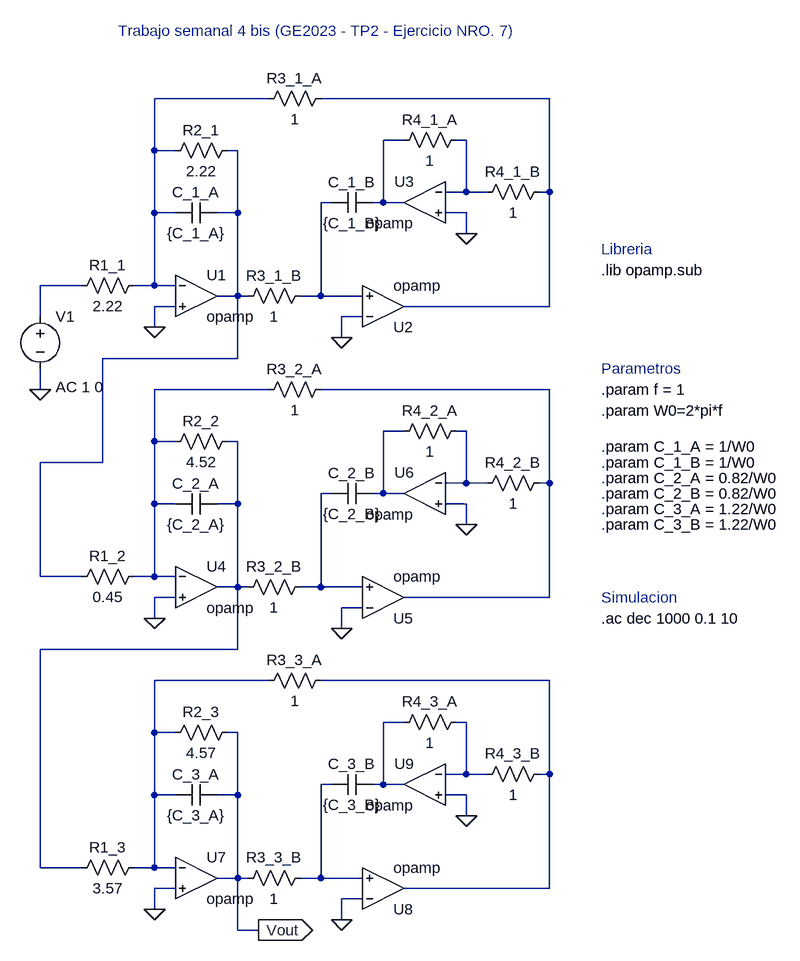
[diagram p0: schematic TS4bis_Albanesi_Pereyra_LTSpice.asc]
TS4bis_Albanesi_Pereyra_LTSpice.asc, the LTspice schematic file:
Version 4
SHEET 1 1068 1256
WIRE 256 -96 80 -96
WIRE 688 -96 336 -96
WIRE 464 -32 432 -32
WIRE 560 -32 544 -32
WIRE 80 -16 80 -96
WIRE 112 -16 80 -16
WIRE 208 -16 192 -16
WIRE 560 48 560 -32
WIRE 560 48 528 48
WIRE 592 48 560 48
WIRE 688 48 688 -96
WIRE 688 48 672 48
WIRE 352 64 336 64
WIRE 432 64 432 -32
WIRE 432 64 416 64
WIRE 464 64 432 64
WIRE 80 80 80 -16
WIRE 112 80 80 80
WIRE 208 80 208 -16
WIRE 208 80 176 80
WIRE 560 80 528 80
WIRE 560 112 560 80
WIRE -32 192 -96 192
WIRE 80 192 80 80
WIRE 80 192 48 192
WIRE 112 192 80 192
WIRE 208 208 208 80
WIRE 208 208 176 208
WIRE 224 208 208 208
WIRE 336 208 336 64
WIRE 336 208 304 208
WIRE 400 208 336 208
WIRE 112 224 80 224
WIRE 688 224 688 48
WIRE 688 224 464 224
WIRE -96 240 -96 192
WIRE 400 240 368 240
WIRE 80 256 80 224
WIRE 368 272 368 240
WIRE 208 304 208 208
WIRE 208 304 0 304
WIRE -96 352 -96 320
WIRE 256 352 80 352
WIRE 688 352 336 352
WIRE 464 416 432 416
WIRE 560 416 544 416
WIRE 80 432 80 352
WIRE 112 432 80 432
WIRE 208 432 192 432
WIRE 0 464 0 304
WIRE 0 464 -96 464
WIRE 560 496 560 416
WIRE 560 496 528 496
WIRE 592 496 560 496
WIRE 688 496 688 352
WIRE 688 496 672 496
WIRE 352 512 336 512
WIRE 432 512 432 416
WIRE 432 512 416 512
WIRE 464 512 432 512
WIRE 80 528 80 432
WIRE 112 528 80 528
WIRE 208 528 208 432
WIRE 208 528 176 528
WIRE 560 528 528 528
WIRE 560 560 560 528
WIRE -96 640 -96 464
WIRE -32 640 -96 640
WIRE 80 640 80 528
WIRE 80 640 48 640
WIRE 112 640 80 640
WIRE 208 656 208 528
WIRE 208 656 176 656
WIRE 224 656 208 656
WIRE 336 656 336 512
WIRE 336 656 304 656
WIRE 400 656 336 656
WIRE 112 672 80 672
WIRE 688 672 688 496
WIRE 688 672 464 672
WIRE 400 688 368 688
WIRE 80 704 80 672
WIRE 368 720 368 688
WIRE 208 752 208 656
WIRE 208 752 -96 752
WIRE 256 800 80 800
WIRE 688 800 336 800
WIRE 464 864 432 864
WIRE 560 864 544 864
WIRE 80 880 80 800
WIRE 112 880 80 880
WIRE 208 880 192 880
WIRE 560 944 560 864
WIRE 560 944 528 944
WIRE 592 944 560 944
WIRE 688 944 688 800
WIRE 688 944 672 944
WIRE 352 960 336 960
WIRE 432 960 432 864
WIRE 432 960 416 960
WIRE 464 960 432 960
WIRE 80 976 80 880
WIRE 112 976 80 976
WIRE 208 976 208 880
WIRE 208 976 176 976
WIRE 560 976 528 976
WIRE 560 1008 560 976
WIRE -96 1088 -96 752
WIRE -32 1088 -96 1088
WIRE 80 1088 80 976
WIRE 80 1088 48 1088
WIRE 112 1088 80 1088
WIRE 208 1104 208 976
WIRE 208 1104 176 1104
WIRE 224 1104 208 1104
WIRE 336 1104 336 960
WIRE 336 1104 304 1104
WIRE 400 1104 336 1104
WIRE 112 1120 80 1120
WIRE 688 1120 688 944
WIRE 688 1120 464 1120
WIRE 400 1136 368 1136
WIRE 80 1152 80 1120
WIRE 368 1168 368 1136
WIRE 208 1184 208 1104
WIRE 240 1184 208 1184
FLAG 80 256 0
FLAG 368 272 0
FLAG 560 112 0
FLAG -96 352 0
FLAG 80 704 0
FLAG 368 720 0
FLAG 560 560 0
FLAG 80 1152 0
FLAG 368 1168 0
FLAG 560 1008 0
FLAG 240 1184 Vout
IOPIN 240 1184 Out
SYMBOL res 64 176 R90
WINDOW 0 0 56 VBottom 2
WINDOW 3 32 56 VTop 2
SYMATTR InstName R1_1
SYMATTR Value 2.22
SYMBOL res 208 -32 R90
WINDOW 0 0 56 VBottom 2
WINDOW 3 32 56 VTop 2
SYMATTR InstName R2_1
SYMATTR Value 2.22
SYMBOL cap 176 64 R90
WINDOW 0 0 32 VBottom 2
WINDOW 3 32 32 VTop 2
SYMATTR InstName C_1_A
SYMATTR Value {C_1_A}
SYMBOL OpAmps\\opamp 144 144 R0
SYMATTR InstName U1
SYMBOL OpAmps\\opamp 432 288 M180
SYMATTR InstName U2
SYMBOL OpAmps\\opamp 496 0 M0
SYMATTR InstName U3
SYMBOL cap 416 48 R90
WINDOW 0 0 32 VBottom 2
WINDOW 3 32 32 VTop 2
SYMATTR InstName C_1_B
SYMATTR Value {C_1_B}
SYMBOL res 320 192 R90
WINDOW 0 0 56 VBottom 2
WINDOW 3 32 56 VTop 2
SYMATTR InstName R3_1_B
SYMATTR Value 1
SYMBOL res 688 32 R90
WINDOW 0 0 56 VBottom 2
WINDOW 3 32 56 VTop 2
SYMATTR InstName R4_1_B
SYMATTR Value 1
SYMBOL res 560 -48 R90
WINDOW 0 0 56 VBottom 2
WINDOW 3 32 56 VTop 2
SYMATTR InstName R4_1_A
SYMATTR Value 1
SYMBOL res 352 -112 R90
WINDOW 0 0 56 VBottom 2
WINDOW 3 32 56 VTop 2
SYMATTR InstName R3_1_A
SYMATTR Value 1
SYMBOL voltage -96 224 R0
WINDOW 123 24 124 Left 2
WINDOW 39 0 0 Left 0
SYMATTR Value2 AC 1 0
SYMATTR InstName V1
SYMATTR Value ""
SYMBOL res 64 624 R90
WINDOW 0 0 56 VBottom 2
WINDOW 3 32 56 VTop 2
SYMATTR InstName R1_2
SYMATTR Value 0.45
SYMBOL res 208 416 R90
WINDOW 0 0 56 VBottom 2
WINDOW 3 32 56 VTop 2
SYMATTR InstName R2_2
SYMATTR Value 4.52
SYMBOL cap 176 512 R90
WINDOW 0 0 32 VBottom 2
WINDOW 3 32 32 VTop 2
SYMATTR InstName C_2_A
SYMATTR Value {C_2_A}
SYMBOL OpAmps\\opamp 144 592 R0
SYMATTR InstName U4
SYMBOL OpAmps\\opamp 432 736 M180
SYMATTR InstName U5
SYMBOL OpAmps\\opamp 496 448 M0
SYMATTR InstName U6
SYMBOL cap 416 496 R90
WINDOW 0 0 32 VBottom 2
WINDOW 3 32 32 VTop 2
SYMATTR InstName C_2_B
SYMATTR Value {C_2_B}
SYMBOL res 320 640 R90
WINDOW 0 0 56 VBottom 2
WINDOW 3 32 56 VTop 2
SYMATTR InstName R3_2_B
SYMATTR Value 1
SYMBOL res 688 480 R90
WINDOW 0 0 56 VBottom 2
WINDOW 3 32 56 VTop 2
SYMATTR InstName R4_2_B
SYMATTR Value 1
SYMBOL res 560 400 R90
WINDOW 0 0 56 VBottom 2
WINDOW 3 32 56 VTop 2
SYMATTR InstName R4_2_A
SYMATTR Value 1
SYMBOL res 352 336 R90
WINDOW 0 0 56 VBottom 2
WINDOW 3 32 56 VTop 2
SYMATTR InstName R3_2_A
SYMATTR Value 1
SYMBOL res 64 1072 R90
WINDOW 0 0 56 VBottom 2
WINDOW 3 32 56 VTop 2
SYMATTR InstName R1_3
SYMATTR Value 3.57
SYMBOL res 208 864 R90
WINDOW 0 0 56 VBottom 2
WINDOW 3 32 56 VTop 2
SYMATTR InstName R2_3
SYMATTR Value 4.57
SYMBOL cap 176 960 R90
WINDOW 0 0 32 VBottom 2
WINDOW 3 32 32 VTop 2
SYMATTR InstName C_3_A
SYMATTR Value {C_3_A}
SYMBOL OpAmps\\opamp 144 1040 R0
SYMATTR InstName U7
SYMBOL OpAmps\\opamp 432 1184 M180
SYMATTR InstName U8
SYMBOL OpAmps\\opamp 496 896 M0
SYMATTR InstName U9
SYMBOL cap 416 944 R90
WINDOW 0 0 32 VBottom 2
WINDOW 3 32 32 VTop 2
SYMATTR InstName C_3_B
SYMATTR Value {C_3_B}
SYMBOL res 320 1088 R90
WINDOW 0 0 56 VBottom 2
WINDOW 3 32 56 VTop 2
SYMATTR InstName R3_3_B
SYMATTR Value 1
SYMBOL res 688 928 R90
WINDOW 0 0 56 VBottom 2
WINDOW 3 32 56 VTop 2
SYMATTR InstName R4_3_B
SYMATTR Value 1
SYMBOL res 560 848 R90
WINDOW 0 0 56 VBottom 2
WINDOW 3 32 56 VTop 2
SYMATTR InstName R4_3_A
SYMATTR Value 1
SYMBOL res 352 784 R90
WINDOW 0 0 56 VBottom 2
WINDOW 3 32 56 VTop 2
SYMATTR InstName R3_3_A
SYMATTR Value 1
TEXT 768 384 Left 2 !.param W0=2*pi*f
TEXT 768 352 Left 2 !.param f = 1
TEXT 768 168 Left 2 !.lib opamp.sub
TEXT 768 136 Left 2 ;Libreria
TEXT 768 320 Left 2 ;Parametros
TEXT 768 440 Left 2 !.param C_1_A = 1/W0
TEXT 768 464 Left 2 !.param C_1_B = 1/W0
TEXT 768 488 Left 2 !.param C_2_A = 0.82/W0
TEXT 768 512 Left 2 !.param C_2_B = 0.82/W0
TEXT 768 536 Left 2 !.param C_3_A = 1.22/W0
TEXT 768 560 Left 2 !.param C_3_B = 1.22/W0
TEXT 768 672 Left 2 ;Simulacion
TEXT 768 704 Left 2 !.ac dec 1000 0.1 10
TEXT 24 -200 Left 2 ;Trabajo semanal 4 bis (GE2023 - TP2 - Ejercicio NRO. 7)

The netlist it stands for:
* TS4bis_Albanesi_Pereyra_LTSpice.asc
R1_1 N001 N007 2.22
R2_1 N005 N001 2.22
C_1_A N005 N001 {C_1_A}
XU1 N001 0 N005 opamp Aol=100K GBW=10Meg  ; pins invin noninvin out
XU2 0 N006 N002 opamp Aol=100K GBW=10Meg  ; pins invin noninvin out
XU3 N004 0 N003 opamp Aol=100K GBW=10Meg  ; pins invin noninvin out
C_1_B N003 N006 {C_1_B}
R3_1_B N006 N005 1
R4_1_B N002 N004 1
R4_1_A N004 N003 1
R3_1_A N002 N001 1
V1 N007 0 AC 1 0
R1_2 N008 N005 0.45
R2_2 N012 N008 4.52
C_2_A N012 N008 {C_2_A}
XU4 N008 0 N012 opamp Aol=100K GBW=10Meg  ; pins invin noninvin out
XU5 0 N013 N009 opamp Aol=100K GBW=10Meg  ; pins invin noninvin out
XU6 N011 0 N010 opamp Aol=100K GBW=10Meg  ; pins invin noninvin out
C_2_B N010 N013 {C_2_B}
R3_2_B N013 N012 1
R4_2_B N009 N011 1
R4_2_A N011 N010 1
R3_2_A N009 N008 1
R1_3 N014 N012 3.57
R2_3 Vout N014 4.57
C_3_A Vout N014 {C_3_A}
XU7 N014 0 Vout opamp Aol=100K GBW=10Meg  ; pins invin noninvin out
XU8 0 N018 N015 opamp Aol=100K GBW=10Meg  ; pins invin noninvin out
XU9 N017 0 N016 opamp Aol=100K GBW=10Meg  ; pins invin noninvin out
C_3_B N016 N018 {C_3_B}
R3_3_B N018 Vout 1
R4_3_B N015 N017 1
R4_3_A N017 N016 1
R3_3_A N015 N014 1
.param W0=2*pi*f
.param f = 1
.lib opamp.sub
* Libreria
* Parametros
.param C_1_A = 1/W0
.param C_1_B = 1/W0
.param C_2_A = 0.82/W0
.param C_2_B = 0.82/W0
.param C_3_A = 1.22/W0
.param C_3_B = 1.22/W0
* Simulacion
.ac dec 1000 0.1 10
* Trabajo semanal 4 bis (GE2023 - TP2 - Ejercicio NRO. 7)
.backanno
.end